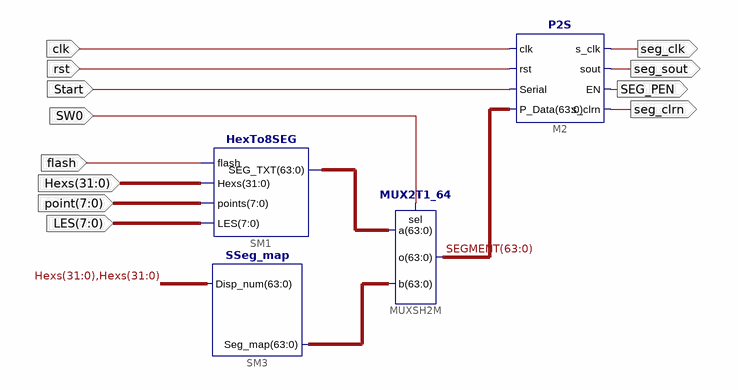
[diagram p0: schematic sheet 1]
// Xilinx ISE schematic Display.sch (kintex7) as structural Verilog: 4 symbols, 12 ports
module Display (
  input  [31:0] Hexs,
  input  [7:0] point,
  input  [7:0] LES,
  input  SW0,
  input  flash,
  input  Start,
  input  rst,
  input  clk,
  output seg_clk,
  output seg_sout,
  output SEG_PEN,
  output seg_clrn
);

  wire [63:0] SEG_MAP, SEGMENT, XLXN_390;

  HexTo8SEG SM1 (.LES(LES), .points(point), .Hexs(Hexs), .SEG_TXT(XLXN_390), .flash(flash));
  SSeg_map SM3 (.Disp_num({Hexs, Hexs}), .Seg_map(SEG_MAP));
  MUX2T1_64 MUXSH2M (.b(SEG_MAP), .sel(SW0), .a(XLXN_390), .o(SEGMENT));
  P2S M2 (
    .s_clrn(seg_clrn), .sout(seg_sout), .rst(rst), .EN(SEG_PEN), .Serial(Start), .clk(clk), .s_clk(seg_clk),
    .P_Data(SEGMENT));
endmodule
